# EAGLE design IRBump (EAGLE 9.5.2)
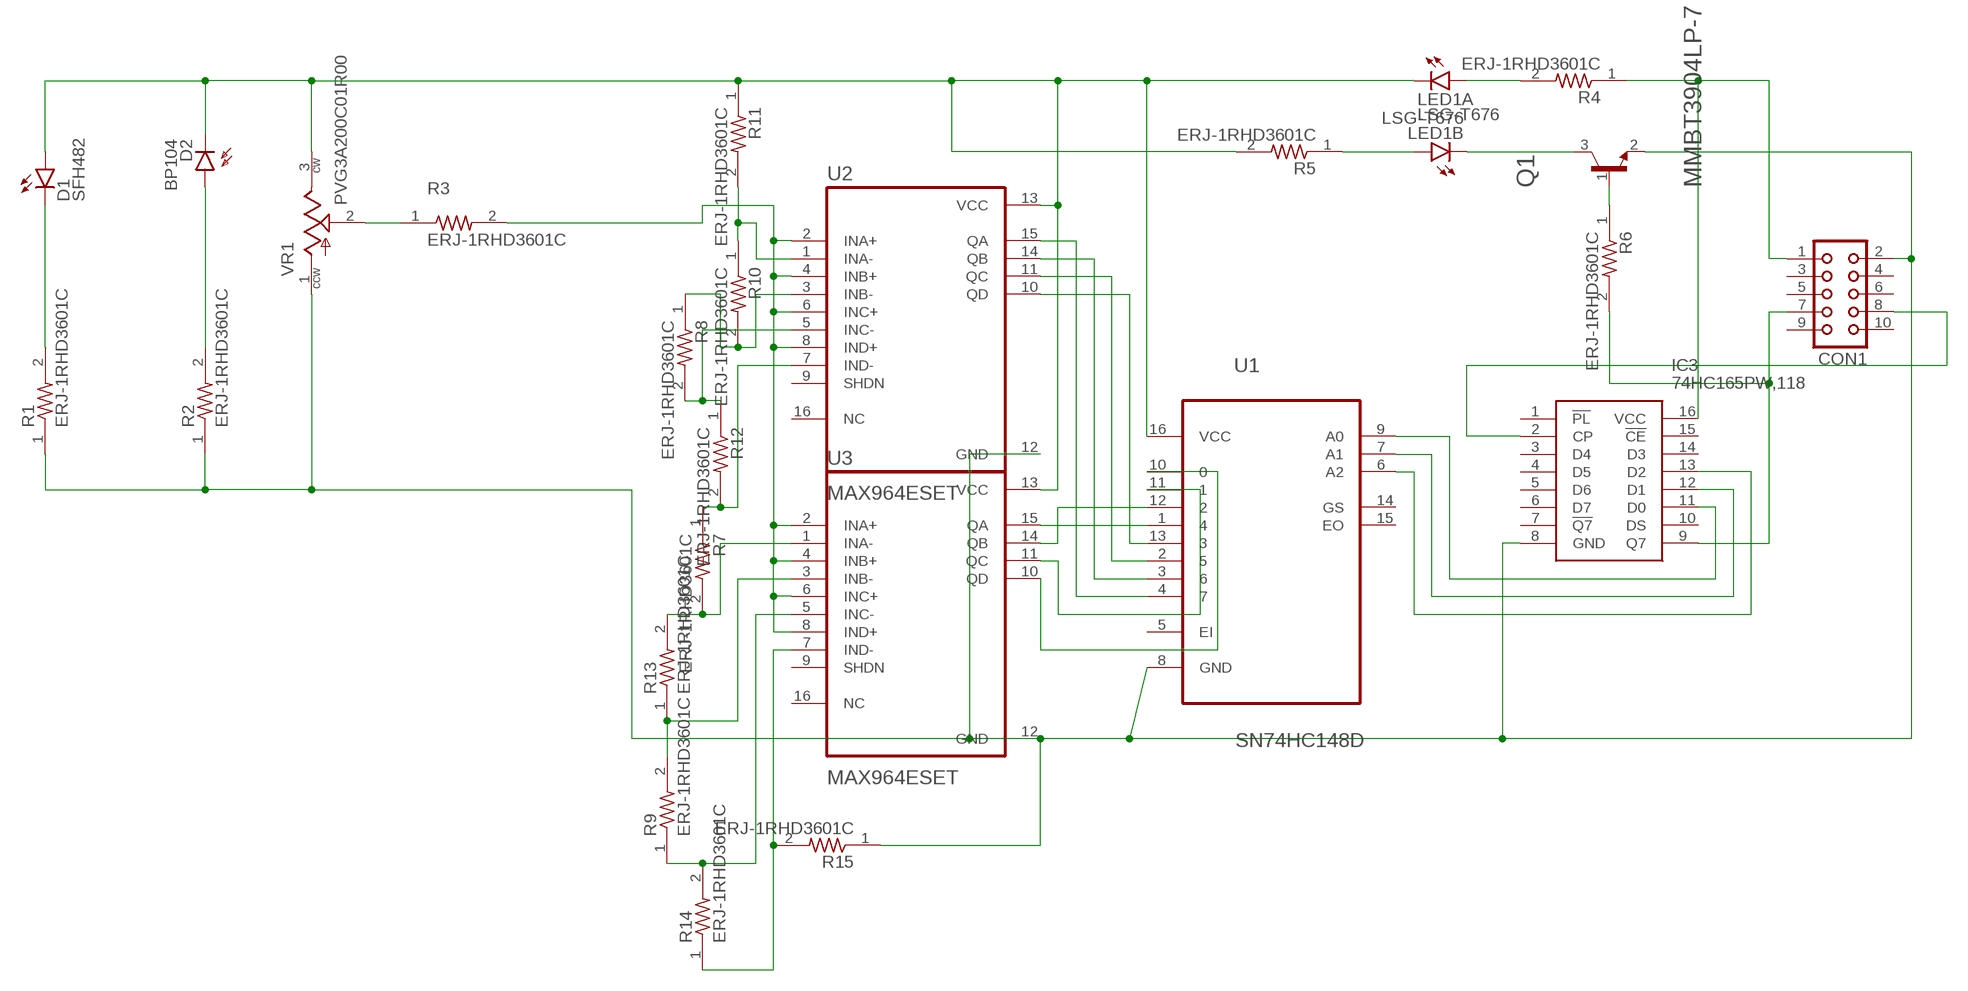
[diagram p0: schematic, sheet 1]

## Parts
CON1  CON10  [CON10]
D1  SFH482  [SFH482]
D2  BP104  [BP104]
IC3  74HC165PW,118  [SOP65P640X110-16N]
LED1  LSG-T676  [P-LCC4-0]
Q1  MMBT3904LP-7  [DFN101X61X53-3N]
R1  ERJ-1RHD3601C  [RESC0603X26N]
R2  ERJ-1RHD3601C  [RESC0603X26N]
R3  ERJ-1RHD3601C  [RESC0603X26N]
R4  ERJ-1RHD3601C  [RESC0603X26N]
R5  ERJ-1RHD3601C  [RESC0603X26N]
R6  ERJ-1RHD3601C  [RESC0603X26N]
R7  ERJ-1RHD3601C  [RESC0603X26N]
R8  ERJ-1RHD3601C  [RESC0603X26N]
R9  ERJ-1RHD3601C  [RESC0603X26N]
R10  ERJ-1RHD3601C  [RESC0603X26N]
R11  ERJ-1RHD3601C  [RESC0603X26N]
R12  ERJ-1RHD3601C  [RESC0603X26N]
R13  ERJ-1RHD3601C  [RESC0603X26N]
R14  ERJ-1RHD3601C  [RESC0603X26N]
R15  ERJ-1RHD3601C  [RESC0603X26N]
U1  SN74HC148D  [SOIC127P600X175-16N]
U2  MAX964ESET  [SOIC127P600X175-16N]
U3  MAX964ESET  [SOIC127P600X175-16N]
VR1  PVG3A200C01R00  [TRIM_PVG3A200C01R00]

## Nets
N$1: R3.2 U2.2(INA+) U2.4(INB+) U2.6(INC+) U2.8(IND+) U3.2(INA+) U3.4(INB+) U3.6(INC+) U3.8(IND+)
N$2: D1.K(C) R1.2
N$3: LED1.4(B:A) R5.1
N$4: CON1.2 IC3.8(GND) Q1.2(E) R1.1 R2.1 R15.1 U1.8(GND) U2.12(GND) U3.12(GND) VR1.1(CCW)
N$5: U1.4 U2.15(QA)
N$6: D1.A D2.K(C) LED1.1(A:C) R5.2 R11.1 U1.16(VCC) U2.13(VCC) U3.13(VCC) VR1.3(CW)
N$7: D2.A R2.2
N$8: LED1.3(B:C) Q1.3(C)
N$9: R10.1 R11.2 U2.1(INA-)
N$10: LED1.2(A:A) R4.2
N$11: R8.1 R10.2 U2.3(INB-)
N$12: Q1.1(B) R6.1
N$13: R8.2 R12.1 U2.5(INC-)
N$14: R3.1 VR1.2(WIPER)
N$15: R7.1 R12.2 U2.7(IND-)
N$16: R7.2 R13.2 U3.1(INA-)
N$17: CON1.1 IC3.16(VCC) R4.1
N$18: R9.2 R13.1 U3.3(INB-)
N$19: R9.1 R14.2 U3.5(INC-)
N$20: R14.1 R15.2 U3.7(IND-)
N$22: U1.3 U2.14(QB)
N$23: U1.2 U2.11(QC)
N$24: U1.13 U2.10(QD)
N$25: U1.1 U3.15(QA)
N$26: CON1.8 IC3.2(CP)
N$27: U1.12 U3.14(QB)
N$28: IC3.11(D0) U1.9(A0)
N$29: IC3.12(D1) U1.7(A1)
N$30: IC3.13(D2) U1.6(A2)
N$31: CON1.7 IC3.9(Q7) R6.2
N$32: U1.11 U3.11(QC)
N$33: U1.10 U3.10(QD)
Unconnected: CON1.3 CON1.4 CON1.5 CON1.6 CON1.9 CON1.10 IC3.1(!PL) IC3.3(D4) IC3.4(D5) IC3.5(D6) IC3.6(D7) IC3.7(!Q7) IC3.10(DS) IC3.14(D3) IC3.15(!CE) U1.5(EI) U1.14(GS) U1.15(EO) U2.9(SHDN) U2.16(NC) U3.9(SHDN) U3.16(NC)

## Library data of the parts
CON1 = con-harting:CON10: CONNECTOR; OC_FARNELL: unknown; OC_NEWARK: unknown
D1 = led:SFH482: IR LED infrared emitting diode, Infineon
D2 = opto-trans-siemens:BP104: PHOTO DIODE; MF: VISHAY/TELEFUNKEN; MPN: BP104; OC_FARNELL: 1779636; OC_NEWARK: 14M4504
IC3 = 74HC165PW_118:74HC165PW,118: 74HC(T)165 - 8-bit parallel-in/serial-out shift register@en-us Source: Datasheet <https://assets.nexperia.com/documents/data-sheet/74HC_HCT165.pdf>; DESCRIPTION: 74HC(T)165 - 8-bit parallel-in/serial-out shift register@en-us; HEIGHT: 1.1mm; MANUFACTURER_NAME: Nexperia; MANUFACTURER_PART_NUMBER: 74HC165PW,118; MOUSER_PART_NUMBER: 771-74HC165PW-T; MOUSER_PRICE-STOCK: https://www.mouser.com/Search/Refine.aspx?Keyword=771-74HC165PW-T
LED1 = led:LSG-T676: LSG T676 Hyper Multi TOPLED ® Hyper-Bright LED Source: http://docs-europe.electrocomponents.com/webdocs/08c3/0900766b808c36ca.pdf
Q1 = NPN BJT:MMBT3904LP-7: MMBT3904LP Series 40 V 200 mA NPN Surface Mount Transistor - DFN1006-3; DESCRIPTION: Bipolar _BJT_ Transistor NPN 40V 200mA 300MHz 250mW Surface Mount 3-DFN1006 _1.0x0.6_; DIGI-KEY_PART_NUMBER: MMBT3904LP-7DICT-ND; DIGI-KEY_PURCHASE_URL: https://www.digikey.com/product-detail/en/diodes-incorporated/MMBT3904LP-7/MMBT3904LP-7DICT-ND/8283872?utm_source=snapeda&utm_medium=aggregator&utm_campaign=symbol; MF: Diodes Inc.; MP: MMBT3904LP-7; PACKAGE: DFN-3 Diodes Inc.
R1-R15 = Resistor:ERJ-1RHD3601C: 0201 chip resistor 0201 SMD resistor 3600ohm 0.5%; AVAILABILITY: Unavailable; DESCRIPTION: 0201 chip resistor 0201 SMD resistor 3600ohm 0.5%; MF: Panasonic; MP: ERJ-1RHD3601C; PACKAGE: 0201 Panasonic; PRICE: None
U1 = SN74HC148D:SN74HC148D: 8:3 line Priority Encoder; AVAILABILITY: Unavailable; DESCRIPTION: IC 8-TO-3 PRIORITY ENCOD 16-SOIC; MF: Texas Instruments; MP: SN74HC148D; PACKAGE: SOIC-16 Texas Instruments; PRICE: None
U2 U3 = MAX964ESET:MAX964ESET; AVAILABILITY: Unavailable; DESCRIPTION: Linear IC - Comparator Maxim Integrated MAX964ESE+ Multi-purpose CMOS, TTL SOIC 16; MF: Maxim Integrated; MP: MAX964ESE+; PACKAGE: SOIC-16 Maxim; PRICE: None
VR1 = TrimmerPot:PVG3A200C01R00: Res Cermet Trimmer 20 Ohm 20% 1/4W 1(Elec)/1(Mech)Turn 2.2mm (3.6 X 3.6 X 2mm) J-Hook SMD T/R; AVAILABILITY: Unavailable; DESCRIPTION: 20 Ohms 0.25W, 1/4W J Lead Surface Mount Trimmer Potentiometer Cermet 1 Turn Top Adjustment; MF: Bourns; MP: PVG3A200C01R00; PACKAGE: TO-221 Bourns; PRICE: None

## Board
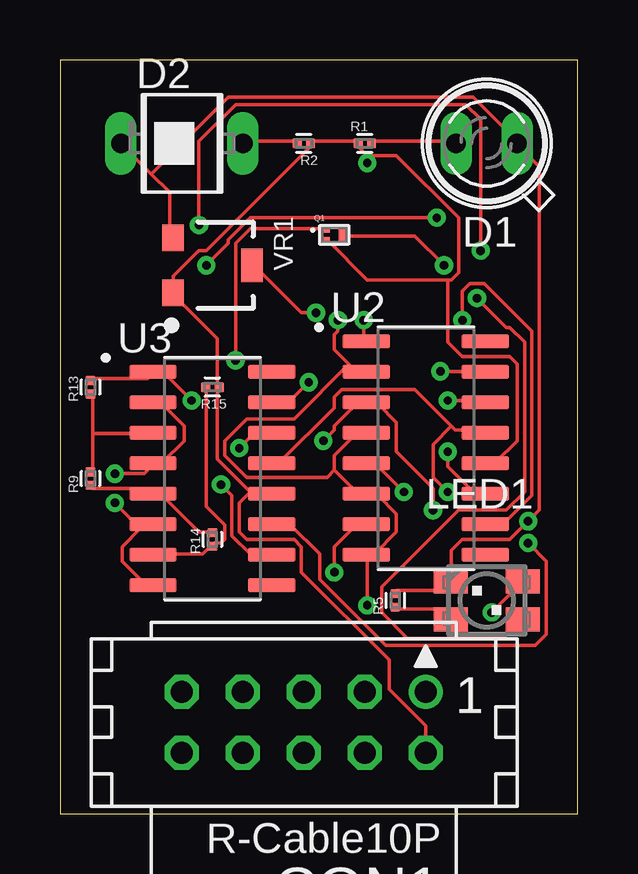
[diagram p1: board, top side]
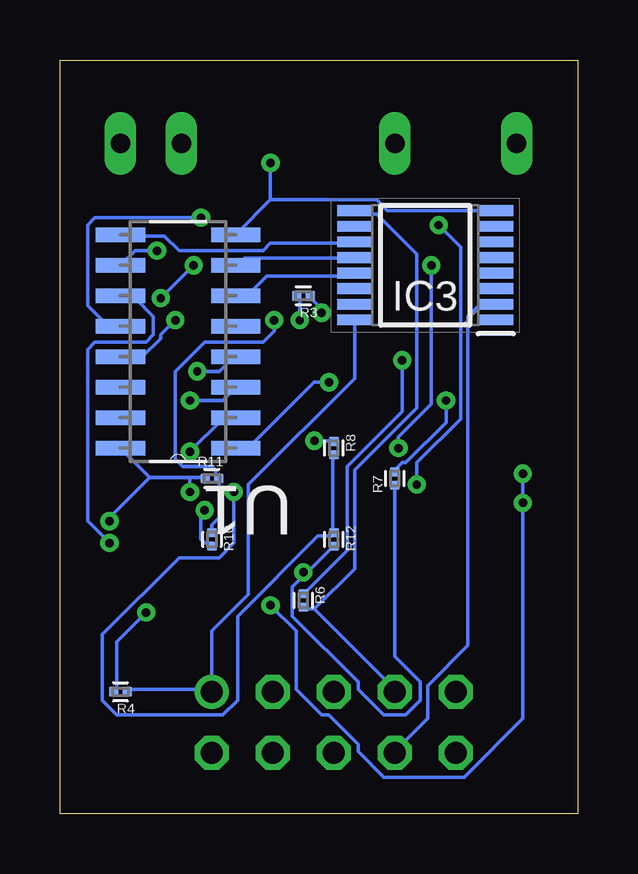
[diagram p2: board, bottom side, seen from below]

Size 21.57 x 31.42 mm. Coordinates in mm from the lower left corner, seen from the top.
Outline: 0,0 21.57,0 21.57,31.42 0,31.42 0,0
Copper layers (1*16): Top 0.035mm / dielectric 1.5mm / Bottom 0.035mm
Design rules "default": minimum track width 6mil, minimum drill 0.35mm, track to track 6mil, track to pad 6mil, pad to pad 6mil, via to via 6mil, smd to smd 6mil, copper to edge 40mil, drill to drill 6mil, minimum pad ring 10mil, minimum via ring 8mil, stop-mask expansion 4mil, vias tented up to drill 0mil, thermal gap 10mil

### Footprints (pad centres in the part's own frame; a part is rotated, then mirrored left to right if it is on the bottom)
CON10 = drill 0.914: 1 -5.08,-1.27 | drill 0.914 octagon: 2 -5.08,1.27; 3 -2.54,-1.27; 4 -2.54,1.27; 5 0,-1.27; 6 0,1.27; 7 2.54,-1.27; 8 2.54,1.27; 9 5.08,-1.27; 10 5.08,1.27
SFH482 = drill 0.813 long: A -1.27,0; K 1.27,0
BP104 = drill 0.813 long: A 0,2.54; K 0,-2.54
SOP65P640X110-16N = smd 1.475 x 0.45: 1 -2.938,2.275; 2 -2.938,1.625; 3 -2.938,0.975; 4 -2.938,0.325; 5 -2.938,-0.325; 6 -2.938,-0.975; 7 -2.938,-1.625; 8 -2.938,-2.275; 9 2.938,-2.275; 10 2.938,-1.625; 11 2.938,-0.975; 12 2.938,-0.325; 13 2.938,0.325; 14 2.938,0.975; 15 2.938,1.625; 16 2.938,2.275
P-LCC4-0 = smd 1 x 1.4: 1 -0.787,-1.5; 2 -0.787,1.5; 3 0.787,1.5; 4 0.787,-1.5
DFN101X61X53-3N = smd 0.28 x 0.17: 1 -0.325,0.175; 2 -0.325,-0.175 | smd 0.28 x 0.52: 3 0.325,0
RESC0603X26N = smd 0.38 x 0.4: 1 -0.28,0; 2 0.28,0
SOIC127P600X175-16N = smd 2.057 x 0.61: 1 -4.801,8.89; 2 -4.801,7.62; 3 -4.801,6.35; 4 -4.801,5.08; 5 -4.801,3.81; 6 -4.801,2.54; 7 -4.801,1.27; 8 -4.801,0; 9 0,0; 10 0,1.27; 11 0,2.54; 12 0,3.81; 13 0,5.08; 14 0,6.35; 15 0,7.62; 16 0,8.89
SOIC127P600X175-16N' = smd 1.97 x 0.59: 1 -2.475,4.445; 2 -2.475,3.175; 3 -2.475,1.905; 4 -2.475,0.635; 5 -2.475,-0.635; 6 -2.475,-1.905; 7 -2.475,-3.175; 8 -2.475,-4.445; 9 2.475,-4.445; 10 2.475,-3.175; 11 2.475,-1.905; 12 2.475,-0.635; 13 2.475,0.635; 14 2.475,1.905; 15 2.475,3.175; 16 2.475,4.445
TRIM_PVG3A200C01R00 = smd 1.1 x 0.9: 1 1.15,-1.65; 3 -1.15,-1.65 | smd 1.4 x 0.9: 2 0,1.65

### Placement (x,y rotation side)
CON1  10.16,3.81 180 top
D1  17.78,27.94 180 top
D2  5.08,27.94 270 top
IC3  6.35,22.86 180 bottom
LED1  17.78,8.89 270 top
Q1  11.43,24.13 0 top
R1  12.7,27.94 0 top
R2  10.16,27.94 180 top
R3  11.43,21.59 180 bottom
R4  19.05,5.08 180 bottom
R5  13.97,8.89 90 top
R6  11.43,8.89 270 bottom
R7  7.62,13.97 90 bottom
R8  10.16,15.24 270 bottom
R9  1.27,13.97 90 top
R10  15.24,11.43 270 bottom
R11  15.24,13.97 0 bottom
R12  10.16,11.43 270 bottom
R13  1.27,17.78 90 top
R14  6.35,11.43 90 top
R15  6.35,17.78 180 top
U1  19.05,24.13 180 bottom
U2  MAX964ESET  [SOIC127P600X175-16N']  15.24,15.24 0 top
U3  MAX964ESET  [SOIC127P600X175-16N']  6.35,13.97 0 top
VR1  6.35,22.86 270 top

### Tracks (layer width: path | path; a pad name or v marks a point on that pad's centre or on a via)
N$1  (via drill 0.35)
  Top 0.152: 3.35,11.89 3.5,12.04 3.81,12.04 U3.6 3.35,11.89 | 3.35,11.89 2.59,11.12 2.59,10.52 3.5,9.6 3.81,9.6 U3.8 | U3.2 3.96,17.07 4.27,17.07 5.18,16.15 5.18,15.54 4.27,14.63 3.96,14.63 U3.4 3.81,14.48 3.5,14.17 v2.29,14.17 | v2.29,12.95 3.35,11.89 | v11.58,20.57 11.58,20.12 11.43,19.96 11.43,19.36 12.04,18.75 | 12.04,18.75 12.34,18.44 12.65,18.44 U2.2 | 11.43,14.33 11.43,14.94 12.34,15.85 12.65,15.85 U2.4 | 11.43,14.33 12.34,13.41 12.65,13.41 U2.6 12.8,13.26 13.26,13.26 14.02,12.5 14.02,11.73 13.11,10.82 12.8,10.82 U2.8 12.8,10.67 v12.8,8.69 | 12.04,18.75 9.75,16.46 7.77,16.46 6.86,15.54 6.86,14.94 7.77,14.02 11.12,14.02 11.43,14.33
  Bottom 0.152: v2.29,14.17 v2.29,12.95 2.29,3.96 4.72,1.52 8.08,1.52 9.14,2.59 9.14,2.9 10.36,4.12 10.67,4.12 11.73,5.18 11.73,7.62 v12.8,8.69 | v11.58,20.57 11.58,21.49 R3.2
N$2
  Top 0.152: R1.2 13.11,28.04 16.46,28.04 D1.K
N$3
  Top 0.152: R5.1 14.02,8.53 15.85,8.53 16.15,8.23 LED1.4
N$4  (via drill 0.35)
  Top 0.152: 16.15,22.25 16.31,22.25 16.61,22.55 16.61,24.84 14.02,27.43 12.8,27.43 | 16.15,22.25 12.8,22.25 11.12,23.93 Q1.2 | 12.8,27.43 12.34,27.89 R1.1 12.34,28.04 10.52,28.04 R2.1 10.36,27.89 10.36,27.74 6.1,23.47 5.79,23.47 4.72,22.4 4.72,21.79 VR1.1 4.72,21.64 6.55,19.81 6.55,17.83 R15.1 6.55,17.68 6.55,14.78 7.92,13.41 | 16.15,22.25 16.15,19.66 16.76,19.05 18.75,19.05 19.05,18.75 19.05,15.54 18.14,14.63 17.83,14.63 U2.12 | 12.8,27.43 v12.8,27.13 | 7.92,13.41 8.69,13.41 U3.12 7.92,13.41 | CON1.2 15.24,3.66 13.72,5.18 13.72,6.4 10.06,10.06 10.06,11.12 9.75,11.43 7.77,11.43 7.47,11.73 7.47,12.95 7.92,13.41
  Bottom 0.152: 12.8,25.6 8.38,25.6 7.92,25.15 3.5,25.15 IC3.8 | 12.8,25.6 14.17,24.23 U1.8 | v12.8,27.13 12.8,25.6
N$5  (via drill 0.35)
  Top 0.152: v15.85,18.44 17.68,18.44 U2.15
  Bottom 0.152: v15.85,18.44 14.94,18.44 14.33,19.05 U1.4
N$6  (via drill 0.35)
  Top 0.152: 16.31,16.15 16.46,16 17.68,16 U2.13 | 16.31,16.15 14.78,17.68 11.73,17.68 11.43,17.37 11.43,16.92 9.14,14.63 8.84,14.63 U3.13 | D2.K 3.81,26.67 | 3.81,26.67 4.57,25.91 4.57,24.08 VR1.3 | R5.2 14.02,9.3 15.85,9.3 16.15,9.6 LED1.1 16.31,9.75 16.31,10.97 16.76,11.43 18.75,11.43 v19.51,12.19 19.96,12.65 19.96,26.98 19.05,27.89 D1.A 19.05,28.04 17.22,29.87 7.01,29.87 3.81,26.67 | 16.31,16.15 15.54,15.39 15.54,14.02 v16.15,13.41
  Bottom 0.152: 17.83,14.02 16.15,14.02 | 16.15,14.02 15.54,14.02 R11.1 | U1.16 17.83,14.02 | 17.83,14.02 19.51,12.34 v19.51,12.19 | 16.15,14.02 v16.15,13.41
N$7
  Top 0.152: R2.2 9.75,28.04 7.62,28.04 D2.A
N$8  (via drill 0.35)
  Top 0.152: v16,22.86 14.78,24.08 11.89,24.08 Q1.3 | v17.37,21.49 18.59,20.27 18.75,20.27 19.36,19.66 19.36,13.41 18.59,12.65 16.61,12.65 13.41,9.45 13.41,8.38 14.48,7.32 18.44,7.32 19.2,8.08 LED1.3
  Bottom 0.152: v17.37,21.49 v16,22.86
N$9  (via drill 0.35)
  Top 0.152: v12.65,20.57 12.65,19.81 U2.1
  Bottom 0.152: R10.1 15.24,12.04 14.94,12.34 14.94,13.87 R11.2 15.09,14.02 15.09,14.33 15.24,14.48 16.46,14.48 16.76,14.78 16.76,18.44 15.54,19.66 13.11,19.66 12.65,20.12 v12.65,20.57
N$10  (via drill 0.35)
  Top 0.152: v17.98,8.38 19.2,9.6 LED1.2
  Bottom 0.152: v17.98,8.38 19.2,7.16 19.2,5.18 R4.2
N$11  (via drill 0.35)
  Top 0.152: v15.54,12.65 15.54,13.56 14.02,15.09 14.02,16.31 13.26,17.07 12.8,17.07 U2.3 12.65,17.07 12.34,17.07 11.43,16.15 11.43,16 v10.97,15.54
  Bottom 0.152: v15.54,12.65 15.7,12.5 15.7,11.43 15.54,11.28 15.24,11.28 R10.2 | v10.97,15.54 10.21,15.54 R8.1
N$12  (via drill 0.35)
  Top 0.152: v7.32,18.9 7.32,23.77 7.92,24.38 10.97,24.38 Q1.1
  Bottom 0.152: v7.32,18.9 7.32,16.76 9.6,14.48 9.6,10.97 11.43,9.14 R6.1
N$13  (via drill 0.35)
  Top 0.152: v14.33,13.41 13.26,14.48 12.8,14.48 U2.5
  Bottom 0.152: R8.2 10.21,14.94 10.21,11.73 R12.1 10.21,11.58 10.82,11.58 14.17,8.23 14.17,4.72 14.78,4.12 19.2,4.12 19.81,4.72 19.81,7.47 16.61,10.67 14.94,10.67 14.33,11.28 v14.33,13.41
N$14  (via drill 0.35)
  Top 0.152: v10.67,20.88 10.06,20.88 8.08,22.86 VR1.2
  Bottom 0.152: v10.67,20.88 10.67,21.03 11.12,21.49 R3.1
N$15  (via drill 0.35)
  Top 0.152: v11.43,10.06 11.43,11.12 12.34,12.04 12.65,12.04 U2.7
  Bottom 0.152: R7.1 7.62,6.55 6.55,5.49 6.55,4.72 7.16,4.12 8.08,4.12 9.14,5.18 9.14,5.49 11.89,8.23 11.89,9.45 11.28,10.06 | 11.28,10.06 10.21,11.12 R12.2 | 11.28,10.06 v11.43,10.06
N$16  (via drill 0.35)
  Top 0.152: R13.2 1.37,18.14 3.66,18.14 3.81,18.29 U3.1 3.96,18.29 4.42,18.29 v5.49,17.22
  Bottom 0.152: v5.49,17.22 5.49,16.31 7.16,14.63 7.32,14.63 7.62,14.33 R7.2
N$17
  Bottom 0.152: 15.24,5.18 18.75,5.18 R4.1 | 15.24,5.18 15.24,7.62 13.72,9.14 13.72,13.72 9.3,18.14 9.3,20.57 IC3.16 | 15.24,5.18 CON1.1
N$18
  Top 0.152: 1.37,15.85 1.37,17.37 R13.1 | 1.37,15.85 1.37,14.33 R9.2 | 1.37,15.85 3.81,15.85 U3.3
N$19
  Top 0.152: R14.2 6.25,11.73 5.79,11.73 4.27,13.26 3.96,13.26 U3.5 3.81,13.41 3.66,13.56 1.37,13.56 R9.1
N$20
  Top 0.152: R15.2 6.1,17.68 6.1,12.8 6.86,12.04 6.86,11.43 6.71,11.28 6.4,11.28 R14.1 6.25,11.12 5.94,10.82 3.96,10.82 U3.7
N$22  (via drill 0.35)
  Top 0.152: v16.15,17.22 17.68,17.22 U2.14
  Bottom 0.152: v16.15,17.22 14.78,17.22 14.33,17.68 U1.3
N$23  (via drill 0.35)
  Top 0.152: v16.15,15.09 16.15,14.48 17.22,13.41 17.68,13.41 U2.11
  Bottom 0.152: v16.15,15.09 14.78,16.46 14.33,16.46 U1.2
N$24  (via drill 0.35)
  Top 0.152: v16.76,20.57 16.76,21.79 17.07,22.1 17.68,22.1 19.66,20.12 19.66,13.26 18.59,12.19 17.83,12.19 U2.10
  Bottom 0.152: v16.76,20.57 17.37,19.96 17.37,19.81 18.14,19.05 U1.13
N$25  (via drill 0.35)
  Top 0.152: v10.36,17.98 9.6,17.22 8.84,17.22 U3.15
  Bottom 0.152: v10.36,17.98 10.97,17.98 13.72,15.24 U1.1
N$26
  Bottom 0.152: IC3.2 3.5,21.18 4.12,21.18 4.57,20.73 4.57,7.01 6.25,5.33 6.25,3.96 7.62,2.59 CON1.8
N$27  (via drill 0.35)
  Top 0.152: v7.47,15.24 8.08,15.85 8.69,15.85 U3.14 | v6.1,22.86 7.01,23.77 7.01,23.93 7.92,24.84 v15.7,24.84
  Bottom 0.152: v7.47,15.24 7.47,15.7 6.1,17.07 v6.1,22.86 | v15.7,24.84 20.12,24.84 20.42,24.54 20.42,21.18 19.66,20.42 19.05,20.42 U1.12
N$28
  Bottom 0.152: IC3.11 9.3,23.77 12.8,23.77 13.11,23.47 16.61,23.47 17.22,24.08 19.05,24.08 U1.9
N$29
  Bottom 0.152: IC3.12 9.3,23.16 13.87,23.16 14.17,22.86 U1.7
N$30
  Bottom 0.152: IC3.13 9.3,22.4 12.95,22.4 13.72,21.64 14.17,21.64 U1.6
N$31
  Bottom 0.152: 10.97,8.53 11.43,8.53 R6.2 | 10.97,8.53 7.62,5.18 CON1.7 | 10.97,8.53 9.3,10.21 9.3,14.33 6.71,16.92 6.71,23.32 8.38,24.99 9.14,24.99 IC3.9
N$32  (via drill 0.35)
  Top 0.152: v19.51,11.28 20.27,10.52 20.27,7.47 19.81,7.01 13.56,7.01 10.82,9.75 10.82,10.82 9.6,12.04 8.84,12.04 U3.11
  Bottom 0.152: v19.51,11.28 20.42,12.19 20.42,19.36 20.12,19.66 17.98,19.66 17.68,19.96 17.68,20.73 18.44,21.49 19.05,21.49 U1.11
N$33  (via drill 0.35)
  Top 0.152: v6.71,13.72 7.16,13.26 7.16,11.58 7.92,10.82 8.69,10.82 U3.10 | v5.79,24.54 5.79,28.04 7.32,29.57 16.92,29.57 17.53,28.96 v17.53,23.47
  Bottom 0.152: v6.71,13.72 6.71,14.63 4.88,16.46 4.88,23.62 v5.79,24.54 | v17.53,23.47 18.44,23.47 U1.10